# Altium schematic sheet MP1477H_DCDC_5V.SchDoc: MP1477H DCDC 5V@3A
size A4; Author: Andrés Gullón; DocumentNumber: 4; SheetNumber: 4; SheetTotal: 9
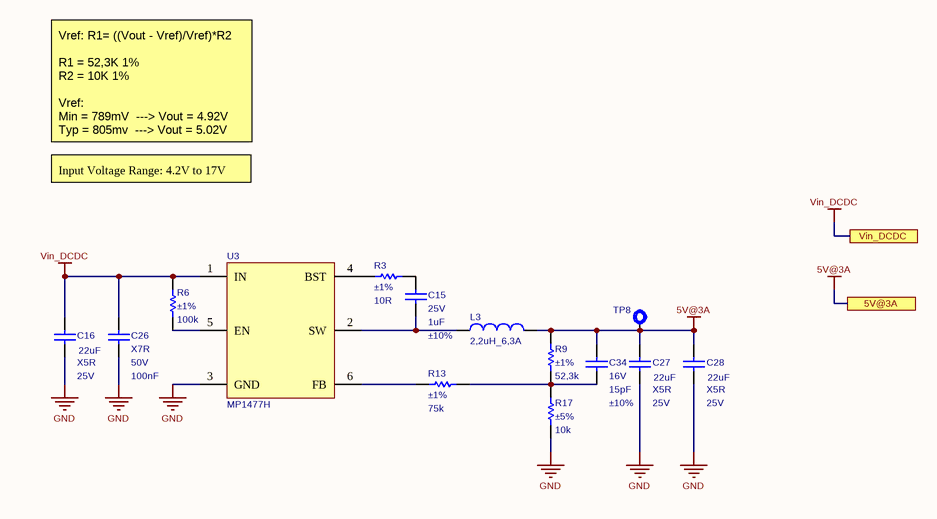
[diagram p0: MP1477H_DCDC_5V.SchDoc]

## Parts
C15  Voltage: 25V  Capacitance: 1uF  Tolerance: ±10%  [C0603]  (hidden comment: C0603_1uF_25V_±10%)
C16  Dielectric: X5R  Voltage: 25V  Capacitance: 22uF  [C1206]  (hidden comment: C1206_22uF_25V_±10%)
C26  Dielectric: X7R  Voltage: 50V  Capacitance: 100nF  [C0603]  (hidden comment: C0603_100nF_50V_±10%_X7R)
C27  Dielectric: X5R  Voltage: 25V  Capacitance: 22uF  [C1206]  (hidden comment: C1206_22uF_25V_±10%)
C28  Dielectric: X5R  Voltage: 25V  Capacitance: 22uF  [C1206]  (hidden comment: C1206_22uF_25V_±10%)
C34  Voltage: 16V  Capacitance: 15pF  Tolerance: ±10%  [C0402]  (hidden comment: C0402_15pF_16V_±10%_C0G)
L3  2,2uH_6,3A  [SRN8040]
R3  Tolerance: ±1%  Resistance: 10R  [R0402]  (hidden comment: R0402_10R_0.063W_±1%)
R6  Tolerance: ±1%  Resistance: 100k  [R0402]  (hidden comment: R0402_100k_0.063W_±1%)
R9  Tolerance: ±1%  Resistance: 52,3k  [R0402]  (hidden comment: R0402_52,3k_0.063W_±1%)
R13  Tolerance: ±1%  Resistance: 75k  [R0402]  (hidden comment: R0402_75k_0.063W_±1%)
R17  Tolerance: ±5%  Resistance: 10k  [R0402]  (hidden comment: R0402_10k_0.063W_±5%)
TP8  TP  [TP_POWER]  (value not drawn)  (no BOM)
U3  MP1477H  [SOT-563 - MP1477H]

## Ports
5V@3A, Vin_DCDC

## Nets
5V@3A: C27.2 C28.2 C34.2 L3.2 R9.1 TP8.1 ; port 5V@3A
GND: C16.1 C26.1 C27.1 C28.1 R17.2 U3.3(GND)
Vin_DCDC: C16.2 C26.2 R6.2 U3.1(IN) ; port Vin_DCDC
NetC15_1: C15.1 L3.1 U3.2(SW)
NetC15_2: C15.2 R3.2
NetC34_1: C34.1 R9.2 R13.2 R17.1
NetR3_1: R3.1 U3.4(BST)
NetR6_1: R6.1 U3.5(EN)
NetR13_1: R13.1 U3.6(FB)

## Notes on the sheet
- Vref: R1= ((Vout - Vref)/Vref)*R2
  R1 = 52,3K 1%
  R2 = 10K 1%
  Vref:
  Min = 789mV  ---> Vout = 4.92V
  Typ = 805mv  ---> Vout = 5.02V
  Max = 821mV  ---> Vout = 5.11V
- Input Voltage Range: 4.2V to 17V
- Title
- Project
- Size:
- Author
- A4
- Number:
- Revision:
- Mundo Reader, S.L. This project and all the sheets and layouts enclosed are licensed under Creative Commons by Attribution and Share Alike [CC BY-SA] (www.creativecommons.com)
- Date:
- Time:
- Sheet
- of

## Library data of the parts
C15 = CMP-A0371-1: Manufacturer: Kemet; Dielectric: X5R; Value: 1uF ±10% 25V; OrderingCode: C0603C105K3PAC; Temp_ Max: 125; Temp_ Min: -55; SchLibComponentName: Capacitor; Part Number: C0603_1uF_25V_±10%; Price units: EUR
C16 C27 C28 = CMP-A0110-1: Manufacturer: Murata; SchLibComponentName: Capacitor; Value: 22uF ±10% 25V; Tolerance: ±10%; OrderingCode: GRM31CR61E226KE15L; Temp_ Max: 85; Temp_ Min: -55; Part Number: C1206_22uF_25V_±10%; Price units: EUR
C26 = CMP-00257-1: Manufacturer: Kemet; Description ES: Condensador; OrderingCode: C0603C104K5RAC; OrderingCode 2: 06035C104KAT2A; SchLibComponentName: Capacitor; Temp_ Max: 125; Temp_ Min: -55; Tolerance: ±10%; Value: 100nF ±10% 50V; Manufacturer 2: AVX; Part Number: C0603_100nF_50V_±10%_X7R; Price units: EUR
C34 = CMP-A0543-2: Manufacturer: Kemet; Dielectric: C0G; Value: 15pF ±10% 16V; OrderingCode: C0402C150K4GAC; Temp_ Max: 125; Temp_ Min: -55; Description ES: Condensador; SchLibComponentName: Capacitor; Part Number: C0402_15pF_16V_±10%; Price units: EUR
L3 = CMP-A0670-2: Semi-shielded power inductor; Manufacturer: Bourns; L: 2,2µH; Rdc: 0,013R; Current: 6,3A; Current Sat#: 7,3A; OrderingCode: SRN8040-2R2Y; Temp_ Max: 105; Temp_ Min: -40; Value: 2,2µH 6,3A; AccessRights: 2147483647; ContentType: Component; Current Sat.: 7,4A; Description ES: Bobina; Folder: Components Library\Pasives\Inductor_SMD\Power Inductor$\; RevisionId: 1; SchLibComponentName: Inductor; Part Number: 2,2uH_6,3A; Price units: EUR; ContentTypeGUID: CB3C11C4-E317-11DF-B822-12313F0024A2; FolderGUID: 60894C29-593F-4616-8F9E-CDB5863F0F96; ItemGUID: EAB2D04B-E49E-443A-801C-32E206E8EAE6; ItemHRID: CMP-A0670; LifeCycle: New From Design; LifeCycleStateGUID: 706004B5-C76E-482E-903B-BA0E4FAE086A; ReleaseDate: 19/02/2016 11:18:53 AM
R3 = CMP-A1838-2: Manufacturer: Vishay; Value: '=Resistance+' '+Tolerance+' '+Power; OrderingCode: CRCW040210R0FK; Power: 0.063W; Temp_ Max: 155; Temp_ Min: -55; Description ES: Resistencia; OrderingCode 2: RC0402FR-0710RL; Temp_Max: 155°C; Temp_Min: -55°C; SchLibComponentName: Resistor; PackageDescription: SMD; Part Number: R0402_10R_0.063W_±1%; Price units: EUR; Manufacturer 2: Yageo
R6 = CMP-A1835-2: Manufacturer: Vishay; Value: 100k ±1% 0.063W; OrderingCode: CRCW0402100KFK; Power: 0.063W; Description ES: Resistencia; Temp_ Max: 155; Temp_ Min: -55; SchLibComponentName: Resistor; PackageDescription: SMD; Part Number: R0402_100k_0.063W_±1%; Price units: EUR
R9 = CMP-A1961-1: Manufacturer: Vishay; Value: 52,3k ±1% 0.063W; OrderingCode: CRCW040252K3FK; Power: 0.063W; Temp_ Max: 155; Temp_ Min: -55; SchLibComponentName: Resistor; PackageDescription: SMD; Part Number: R0402_52,3k_0.063W_±1%; Price units: EUR
R13 = CMP-A1985-2: Manufacturer: Vishay; Value: 75k ±1% 0.063W; OrderingCode: CRCW040275K0FK; Power: 0.063W; Temp_ Max: 155; Temp_ Min: -55; Description ES: Resistencia; OrderingCode 2: RC0402FR-0775KL; Temp_Max: 155°C; Temp_Min: -55°C; SchLibComponentName: Resistor; PackageDescription: SMD; Part Number: R0402_75k_0.063W_±1%; Price units: EUR; Manufacturer 2: Yageo
R17 = CMP-A1692-4: Manufacturer: Vishay; Value: 10k ±5% 0.063W; SchLibComponentName: Resistor; OrderingCode: CRCW040210K0JN; Power: 0.063W; Temp_ Max: 155; Temp_ Min: -55; Description ES: Resistencia; OrderingCode 2: RC0402JR-0710KL; Temp_Max: 155°C; Temp_Min: -55°C; PackageDescription: SMD; Part Number: R0402_10k_0.063W_±5%; Price units: EUR; Manufacturer 2: Yageo
TP8 = CMP-A2499-3: Testpoint 0.3mm; Manufacturer: Oxley; OrderingCode: SMOX/060/B1; SAP: 303552; SchLibComponentName: Testpoint; Part Number: TP_POWER; Price units: EUR
U3 = CMP-00385-3: DCDC Step Down Vout= 1-5V; Vin= 12-17V; Manufacturer: MPS; Description ES: Regulador de voltaje; OrderingCode: MP1477GTF-Z; Temp_Max: 125; Temp_Min: -40; Part Number: MP1477GTF-Z; Price units: EUR